# Altium schematic sheet Data Logger.SchDoc: =DocumentName
size A4; Organization: Queen's Formula SAE; Address1: 130 Stuart St, Kingston; Address2: Ontario; Address3: Canada; Address4: K7L 2V9; DocumentNumber: 1; Revision: 0; SheetNumber: 1; SheetTotal: 1
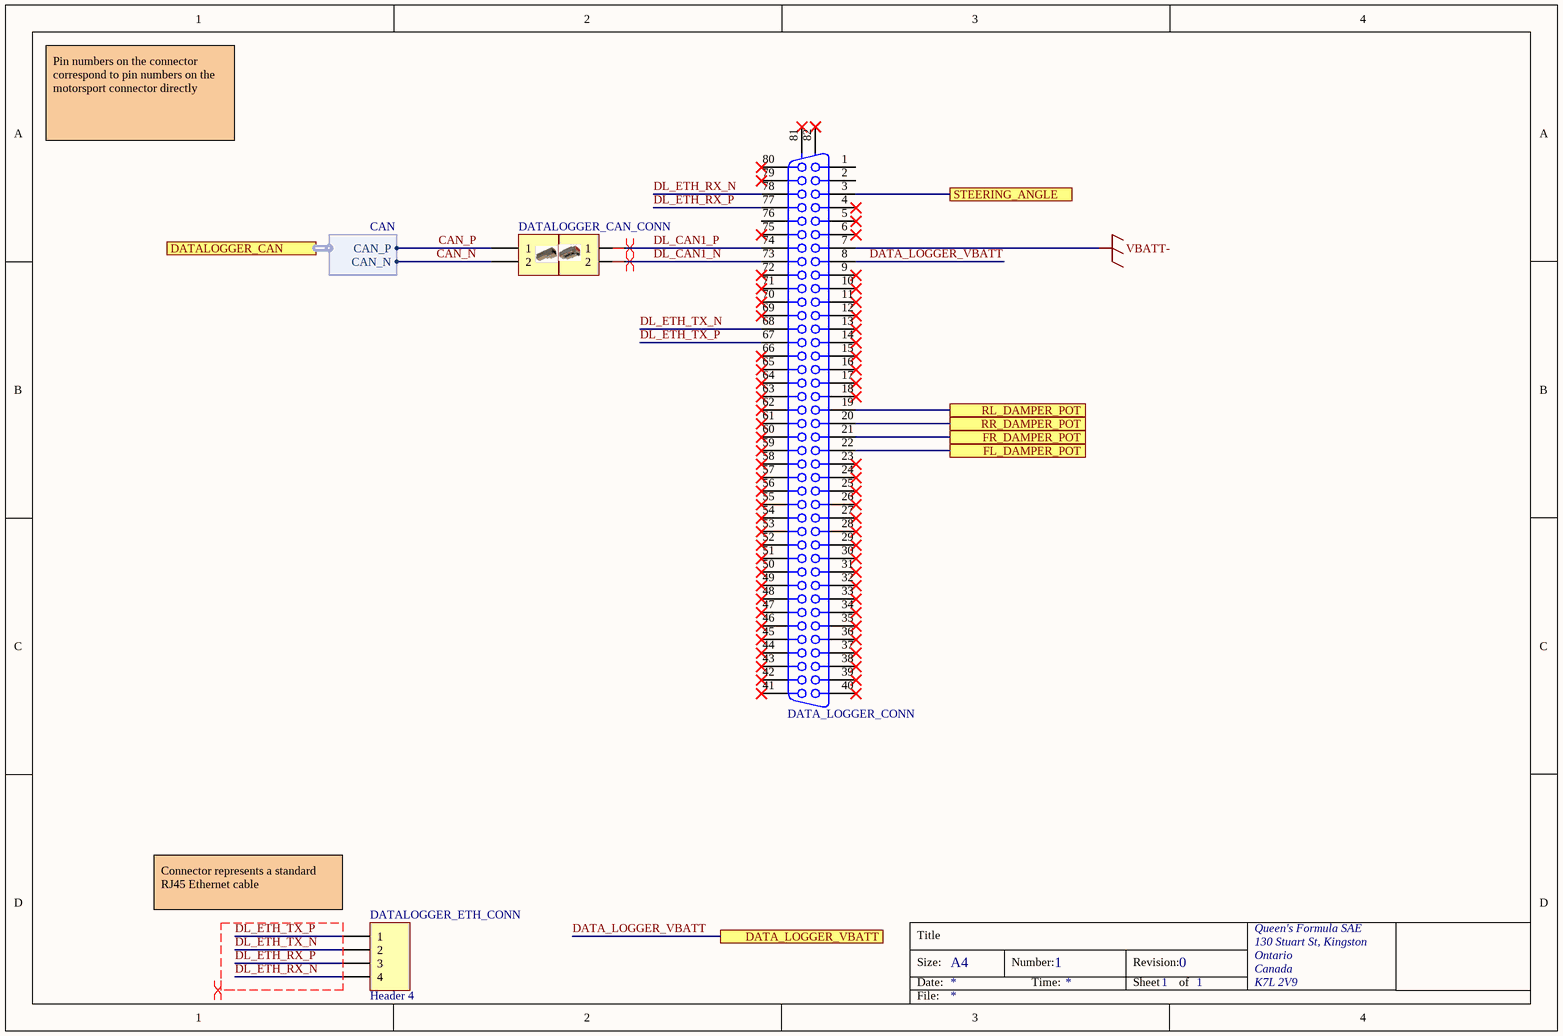
[diagram p0: Data Logger.SchDoc]

## Parts
DATA_LOGGER_CAN_CONN  Header 2  [HDR1X2]  (value not drawn)
DATA_LOGGER_CONN  Connector 80  [CHAMP1.27-2V80]  (value not drawn)
DATALOGGER_CAN_CONN  Header 2  [HDR1X2]  (value not drawn)
DATALOGGER_ETH_CONN  Header 4  [HDR1X4]

## Ports
DATA_LOGGER_VBATT, DATALOGGER_CAN (harness CAN), FL_DAMPER_POT, FR_DAMPER_POT, RL_DAMPER_POT, RR_DAMPER_POT, STEERING_ANGLE

## Harnesses
CAN: CAN_P, CAN_N

## Nets
VBATT-: DATA_LOGGER_CONN.7
CAN_N: DATALOGGER_CAN_CONN.2 ; port DATALOGGER_CAN.CAN_N
CAN_P: DATALOGGER_CAN_CONN.1 ; port DATALOGGER_CAN.CAN_P
DATA_LOGGER_VBATT: DATA_LOGGER_CONN.8 ; port DATA_LOGGER_VBATT
DL_CAN1_N: DATA_LOGGER_CAN_CONN.2 DATA_LOGGER_CONN.73
DL_CAN1_P: DATA_LOGGER_CAN_CONN.1 DATA_LOGGER_CONN.74
DL_ETH_RX_N: DATA_LOGGER_CONN.78 DATALOGGER_ETH_CONN.4
DL_ETH_RX_P: DATA_LOGGER_CONN.77 DATALOGGER_ETH_CONN.3
DL_ETH_TX_N: DATA_LOGGER_CONN.68 DATALOGGER_ETH_CONN.2
DL_ETH_TX_P: DATA_LOGGER_CONN.67 DATALOGGER_ETH_CONN.1
FL_DAMPER_POT: DATA_LOGGER_CONN.22 ; port FL_DAMPER_POT
FR_DAMPER_POT: DATA_LOGGER_CONN.21 ; port FR_DAMPER_POT
RL_DAMPER_POT: DATA_LOGGER_CONN.19 ; port RL_DAMPER_POT
RR_DAMPER_POT: DATA_LOGGER_CONN.20 ; port RR_DAMPER_POT
STEERING_ANGLE: DATA_LOGGER_CONN.3 ; port STEERING_ANGLE

Not connected (* = marked no-connect by the designer): DATA_LOGGER_CONN 1 2 4* 5* 6* 9* 10* 11* 12* 13* 14* 15* 16* 17* 18* 23* 24* 25* 26* 27* 28* 29* 30* 31* 32* 33* 34* 35* 36* 37* 38* 39* 40* 41* 42* 43* 44* 45* 46* 47* 48* 49* 50* 51* 52* 53* 54* 55* 56* 57* 58* 59* 60* 61* 62* 63* 64* 65* 66* 69* 70* 71* 72* 75* 76 79* 80* 81(MH1)* 82(MH2)*

## Layout directives
differential pair: (no net found under the mark), DL_ETH_RX_N, DL_ETH_RX_P, DL_ETH_TX_N, DL_ETH_TX_P

## Notes on the sheet
- Pin numbers on the connector correspond to pin numbers on the motorsport connector directly
- (near DATALOGGER_ETH_CONN) Connector represents a standard RJ45 Ethernet cable
- Title
- Size:
- Date:
- A4
- Number:
- Time:
- Revision:
- Sheet
- of
- File:

## Library data of the parts
DATA_LOGGER_CAN_CONN DATALOGGER_CAN_CONN = Header 2: Header, 2-Pin; LatestRevisionDate: 17-Jul-2002; LatestRevisionNote: Re-released for DXP Platform.; Publisher: Altium Limited
DATA_LOGGER_CONN = Connector 80: Receptacle Header Assemby; PackageDocument: C; Positions: 80; Published: 15-Jun-2001; LatestRevisionDate: 17-Jul-2002; LatestRevisionNote: Re-released for DXP Platform.; DatasheetDocument: 1-Oct-1983; PackageReference: 917334; Publisher: Altium Limited; Orientation: Vertical
DATALOGGER_ETH_CONN = Header 4: Header, 4-Pin; LatestRevisionDate: 17-Jul-2002; LatestRevisionNote: Re-released for DXP Platform.; Publisher: Altium Limited